# Altium schematic sheet alimentacion.SchDoc
size 431 x 279 mm; SheetNumber: 1; SheetTotal: 2
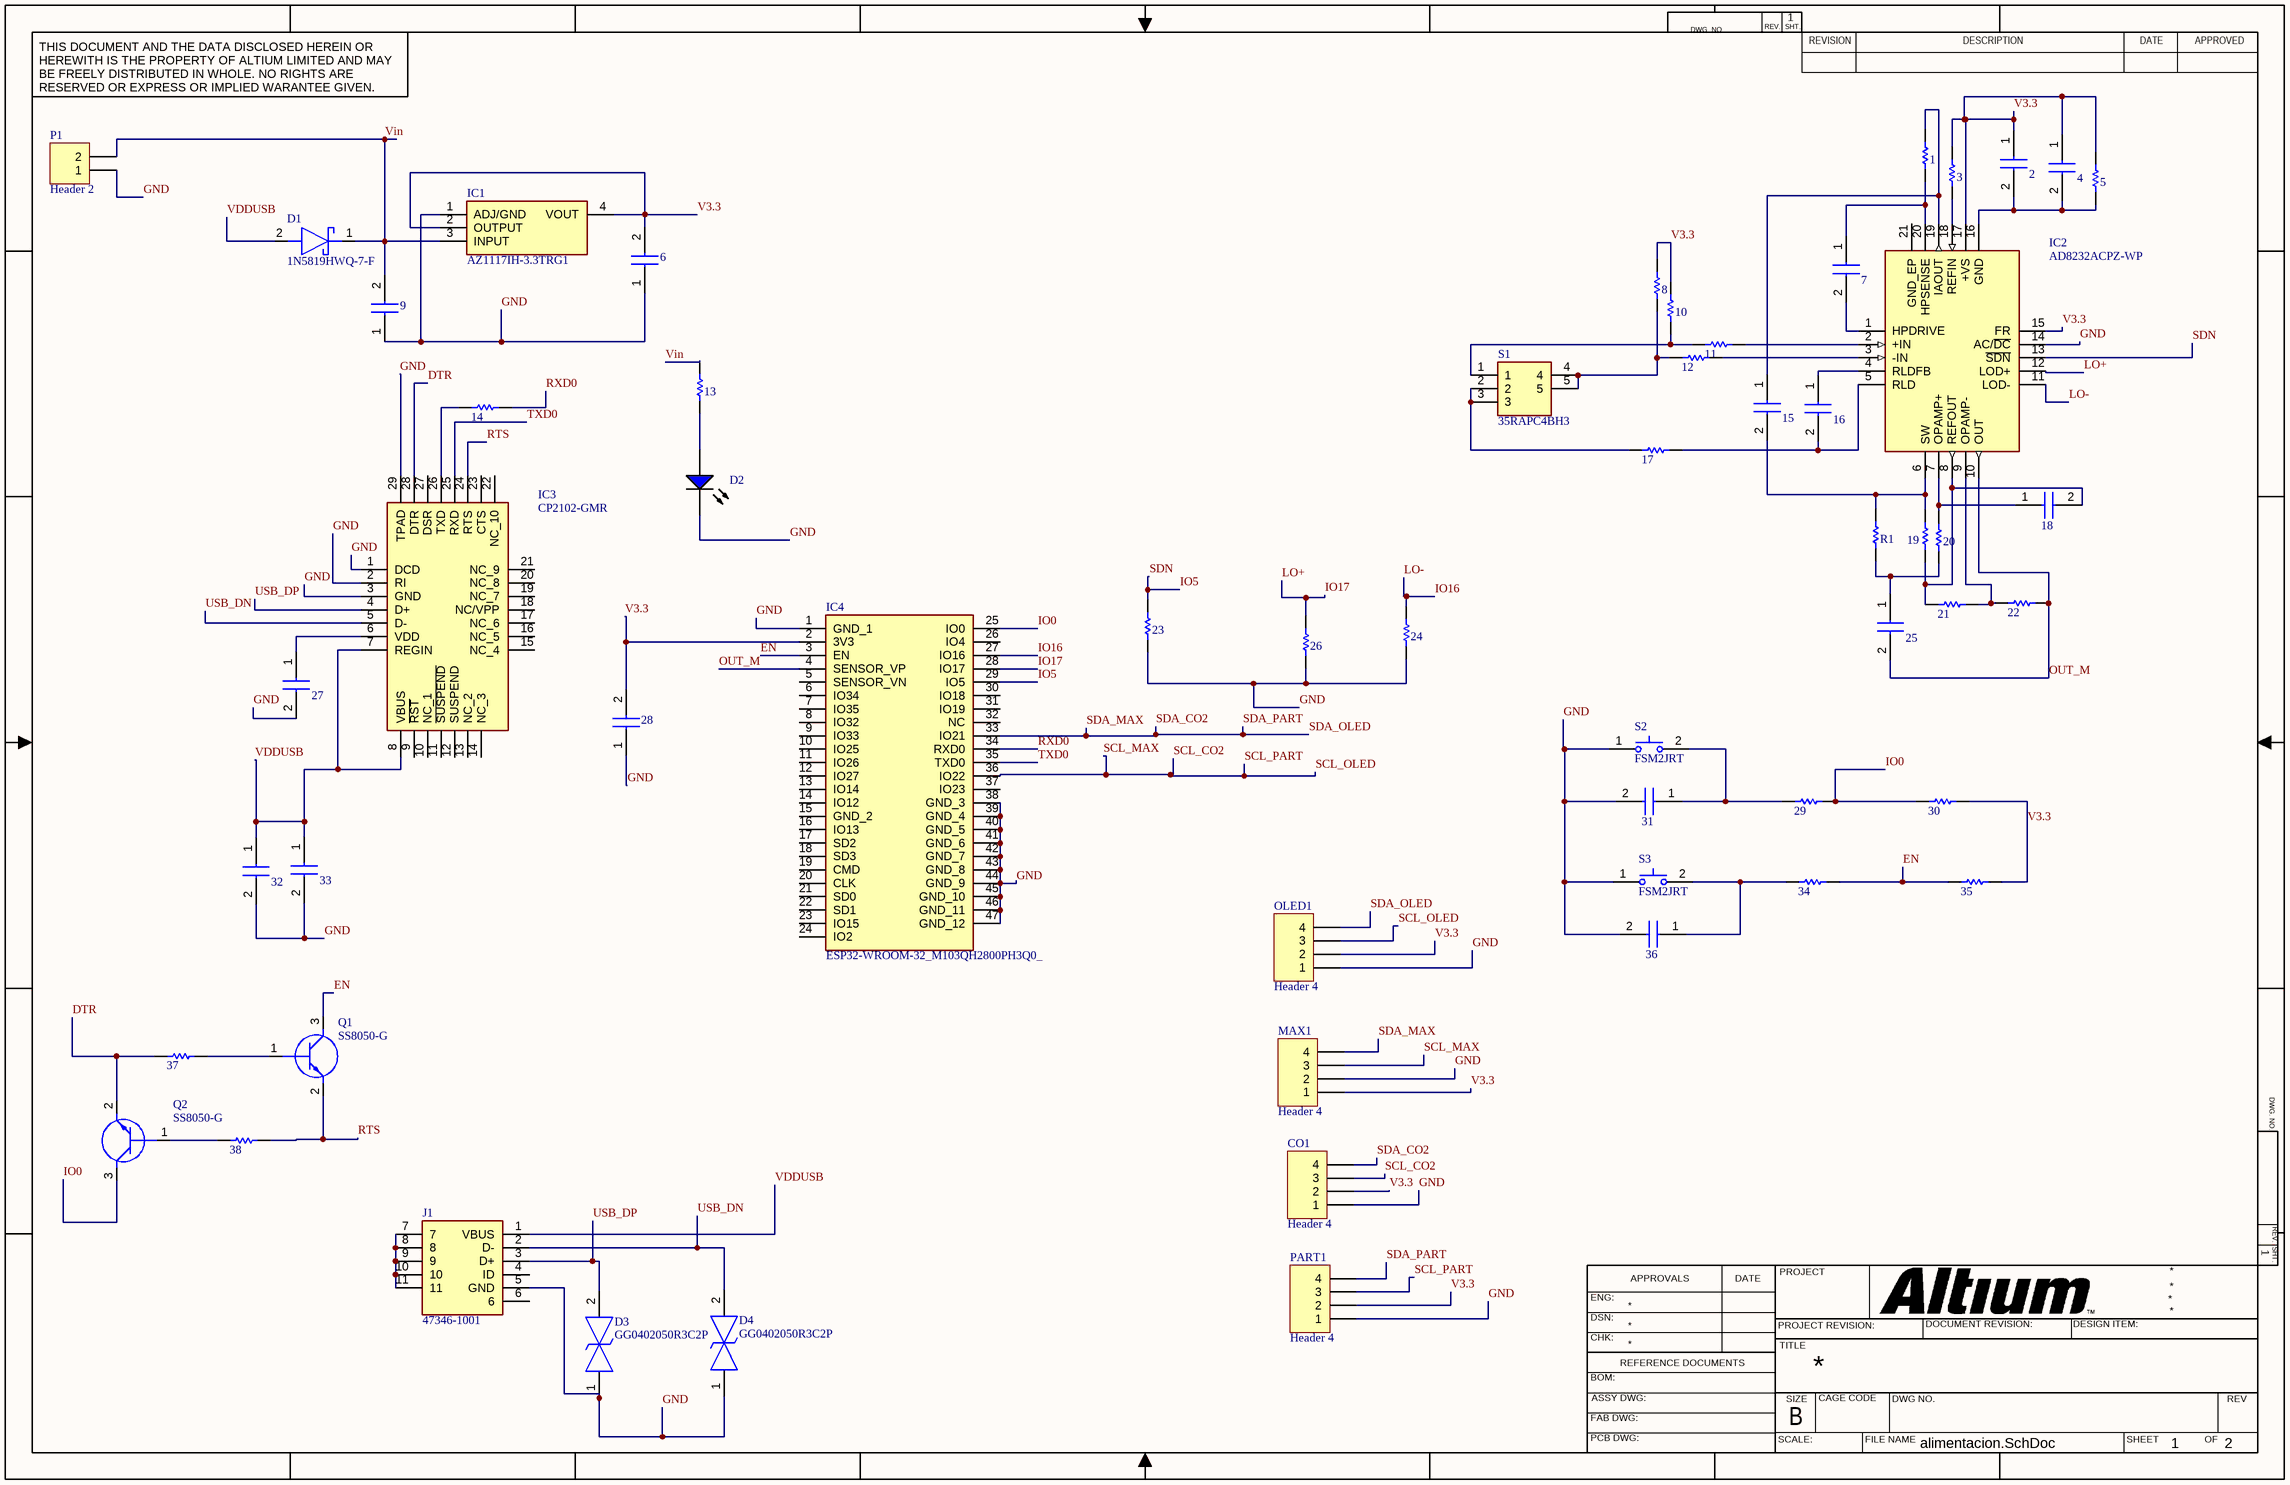
[diagram p0: alimentacion.SchDoc]

## Parts
1  ERA3AEB1131V  [RESC1608X55X30ML20T20]  (value not drawn)
2  C0603C103J5RAC  [CAPC1608X87N]  (value not drawn)
3  ERA3AEB1131V  [RESC1608X55X30ML20T20]  (value not drawn)
4  C0603C103J5RAC  [CAPC1608X87N]  (value not drawn)
5  ERA3AEB1131V  [RESC1608X55X30ML20T20]  (value not drawn)
6  C0603C103J5RAC  [CAPC1608X87N]  (value not drawn)
7  C0603C103J5RAC  [CAPC1608X87N]  (value not drawn)
8  ERA3AEB1131V  [RESC1608X55X30ML20T20]  (value not drawn)
9  C0603C103J5RAC  [CAPC1608X87N]  (value not drawn)
10  ERA3AEB1131V  [RESC1608X55X30ML20T20]  (value not drawn)
11  ERA3AEB1131V  [RESC1608X55X30ML20T20]  (value not drawn)
12  ERA3AEB1131V  [RESC1608X55X30ML20T20]  (value not drawn)
13  ERA3AEB1131V  [RESC1608X55X30ML20T20]  (value not drawn)
14  ERA3AEB1131V  [RESC1608X55X30ML20T20]  (value not drawn)
15  C0603C103J5RAC  [CAPC1608X87N]  (value not drawn)
16  C0603C103J5RAC  [CAPC1608X87N]  (value not drawn)
17  ERA3AEB1131V  [RESC1608X55X30ML20T20]  (value not drawn)
18  C0603C103J5RAC  [CAPC1608X87N]  (value not drawn)
19  ERA3AEB1131V  [RESC1608X55X30ML20T20]  (value not drawn)
20  ERA3AEB1131V  [RESC1608X55X30ML20T20]  (value not drawn)
21  ERA3AEB1131V  [RESC1608X55X30ML20T20]  (value not drawn)
22  ERA3AEB1131V  [RESC1608X55X30ML20T20]  (value not drawn)
23  ERA3AEB1131V  [RESC1608X55X30ML20T20]  (value not drawn)
24  ERA3AEB1131V  [RESC1608X55X30ML20T20]  (value not drawn)
25  C0603C103J5RAC  [CAPC1608X87N]  (value not drawn)
26  ERA3AEB1131V  [RESC1608X55X30ML20T20]  (value not drawn)
27  C0603C103J5RAC  [CAPC1608X87N]  (value not drawn)
28  C0603C103J5RAC  [CAPC1608X87N]  (value not drawn)
29  ERA3AEB1131V  [RESC1608X55X30ML20T20]  (value not drawn)
30  ERA3AEB1131V  [RESC1608X55X30ML20T20]  (value not drawn)
31  C0603C103J5RAC  [CAPC1608X87N]  (value not drawn)
32  C0603C103J5RAC  [CAPC1608X87N]  (value not drawn)
33  C0603C103J5RAC  [CAPC1608X87N]  (value not drawn)
34  ERA3AEB1131V  [RESC1608X55X30ML20T20]  (value not drawn)
35  ERA3AEB1131V  [RESC1608X55X30ML20T20]  (value not drawn)
36  C0603C103J5RAC  [CAPC1608X87N]  (value not drawn)
37  ERA3AEB1131V  [RESC1608X55X30ML20T20]  (value not drawn)
38  ERA3AEB1131V  [RESC1608X55X30ML20T20]  (value not drawn)
CO1  Header 4  [HDR1X4]
D1  1N5819HWQ-7-F  [SOD3716X145N]
D2  TLMB1100-GS08  [VISH-TLMX1100-2_V]  (value not drawn)
D3  GG0402050R3C2P  [DIONC1006X55N]
D4  GG0402050R3C2P  [DIONC1006X55N]
IC1  AZ1117IH-3.3TRG1  [SOT230P700X180-4N]
IC2  AD8232ACPZ-WP  [QFN50P400X400X80-21N-D]
IC3  CP2102-GMR  [QFN50P500X500X100-29N-D]
IC4  ESP32-WROOM-32_M103QH2800PH3Q0_  [ESP32WROOM32M103QH2800PH3Q0]
J1  47346-1001  [473461001]
MAX1  Header 4  [HDR1X4]
OLED1  Header 4  [HDR1X4]
P1  Header 2  [HDR1X2]
PART1  Header 4  [HDR1X4]
Q1  SS8050-G  [SOT95P240X115-3N]
Q2  SS8050-G  [SOT95P240X115-3N]
R1  ERA3AEB1131V  [RESC1608X55X30ML20T20]  (value not drawn)
S1  35RAPC4BH3  [35RAPC4BH3]
S2  FSM2JRT  [FSM2JRT]
S3  FSM2JRT  [FSM2JRT]

## Nets
DTR: 37.2 IC3.28(DTR) Q2.2(E)
EN: 34.1 35.2 IC4.3(EN) Q1.3(C)
GND: 6.1 9.1 23.2 24.2 26.2 27.2 28.1 31.2 32.2 33.2 36.2 CO1.1 D2.2(K) D3.1 D4.1 IC1.1(ADJ/GND) IC2.14(AC/~{DC}) IC3.1(DCD) IC3.2(RI) IC3.3(GND) IC3.29(TPAD) IC4.1(GND_1) IC4.38(GND_3) IC4.39(GND_4) IC4.40(GND_5) IC4.41(GND_6) IC4.42(GND_7) IC4.43(GND_8) IC4.44(GND_9) IC4.45(GND_10) IC4.46(GND_11) IC4.47(GND_12) J1.5(GND) MAX1.2 OLED1.1 P1.1 PART1.1 S2.1(COM) S3.1(COM)
IO0: 29.1 30.2 IC4.25(IO0) Q2.3(C)
IO5: 23.1 IC2.13(~{SDN}) IC4.29(IO5)  [also labelled SDN]
IO16: 24.1 IC2.11(LOD-) IC4.27(IO16)  [also labelled LO-]
IO17: 26.1 IC2.12(LOD+) IC4.28(IO17)  [also labelled LO+]
OUT_M: 22.1 25.2 IC2.10(OUT) IC4.4(SENSOR_VP)
RTS: 38.1 IC3.24(RTS) Q1.2(E)
RXD0: 14.1 IC4.34(RXD0)
SCL_CO2: CO1.3 IC4.36(IO22) MAX1.3 OLED1.3 PART1.3  [also labelled SCL_MAX, SCL_OLED, SCL_PART]
SDA_CO2: CO1.4 IC4.33(IO21) MAX1.4 OLED1.4 PART1.4  [also labelled SDA_MAX, SDA_OLED, SDA_PART]
TXD0: IC3.25(RXD) IC4.35(TXD0)
USB_DN: D4.2 IC3.5(D-) J1.2(D-)
USB_DP: D3.2 IC3.4(D+) J1.3(D+)
V3.3: 2.1 3.1 4.1 5.1 6.2 8.1 10.1 28.2 30.1 35.1 CO1.2 IC1.2(OUTPUT) IC1.4(VOUT) IC2.15(FR) IC2.17(+VS) IC4.2(3V3) MAX1.1 OLED1.2 PART1.2
VDDUSB: 32.1 33.1 D1.2(A) IC3.7(REGIN) IC3.8(VBUS) J1.1(VBUS)
Vin: 9.2 13.2 D1.1(K) IC1.3(INPUT) P1.2
Net1_1: 1.1 15.1 IC2.19(IAOUT)
Net1_2: 1.2 7.1 IC2.20(HPSENSE)
Net2_2: 2.2 4.2 5.2 IC2.16(GND)
Net3_2: 3.2 IC2.18(REFIN)
Net7_2: 7.2 IC2.1(HPDRIVE)
Net8_2: 8.2 12.2 S1.4 S1.5
Net10_2: 10.2 11.2 S1.1
Net11_1: 11.1 IC2.2(+IN)
Net12_1: 12.1 IC2.3(-IN)
Net13_1: 13.1 D2.1(A)
Net14_2: 14.2 IC3.26(TXD)
Net15_2: 15.2 19.1 IC2.6(SW) R1.1
Net16_1: 16.1 IC2.4(RLDFB)
Net16_2: 16.2 17.2 IC2.5(RLD)
Net17_1: 17.1 S1.2 S1.3
Net18_1: 18.1 20.1 IC2.7(OPAMP+)
Net18_2: 18.2 19.2 21.1 IC2.8(REFOUT)
Net20_2: 20.2 25.1 R1.2
Net21_2: 21.2 22.2 IC2.9(OPAMP-)
Net27_1: 27.1 IC3.6(VDD)
Net29_2: 29.2 31.1 S2.2(NO)
Net34_2: 34.2 36.1 S3.2(NO)
Net37_1: 37.1 Q1.1(B)
Net38_2: 38.2 Q2.1(B)
NetJ1_7: J1.7 J1.8 J1.9 J1.10 J1.11

Not connected (* = marked no-connect by the designer): IC2 21(GND_EP); IC3 9(~{RST}) 10(NC_1) 11(~{SUSPEND}) 12(SUSPEND) 13(NC_2) 14(NC_3) 15(NC_4) 16(NC_5) 17(NC_6) 18(NC/VPP) 19(NC_7) 20(NC_8) 21(NC_9) 22(NC_10) 23(CTS) 27(DSR); IC4 5(SENSOR_VN) 6(IO34) 7(IO35) 8(IO32) 9(IO33) 10(IO25) 11(IO26) 12(IO27) 13(IO14) 14(IO12) 15(GND_2) 16(IO13) 17(SD2) 18(SD3) 19(CMD) 20(CLK) 21(SD0) 22(SD1) 23(IO15) 24(IO2) 26(IO4) 30(IO18) 31(IO19) 32(NC) 37(IO23); J1 4(ID) 6

## Notes on the sheet
- DWG. NO.
- REV.
- SHT.
- THIS DOCUMENT AND THE DATA DISCLOSED HEREIN OR HEREWITH IS THE PROPERTY OF ALTIUM LIMITED AND MAY BE FREELY DISTRIBUTED IN WHOLE. NO RIGHTS ARE RESERVED OR EXPRESS OR IMPLIED WARANTEE GIVEN.
- REVISION
- DESCRIPTION
- DATE
- APPROVED
- ENG:
- APPROVALS
- PROJECT
- DSN:
- CHK:
- REFERENCE DOCUMENTS
- PROJECT REVISION:
- TITLE
- DOCUMENT REVISION:
- DESIGN ITEM:
- BOM:
- FAB DWG:
- PCB DWG:
- ASSY DWG:
- SCALE:
- SIZE
- B
- CAGE CODE
- FILE NAME
- DWG NO.
- SHEET
- OF
- REV

## Library data of the parts
1 3 5 8 10-14 17 19-24 26 29 30 34 35 37 38 R1 = CMP-2000-00883-1: Manufacturer: Panasonic; Part Number: ERA3AEB1131V
2 4 6 7 9 15 16 18 25 27 28 31-33 36 = C0603C103J5RAC: Capacitor; Manufacturer_Name: KEMET; Datasheet Link: https://www.kemet.com/specsheet/C0603C103J5RAC%7BBULK%7D; Height: 0.87mm; Manufacturer_Part_Number: C0603C103J5RAC; Mouser Part Number: 80-C0603C103J5RAC; Mouser Price/Stock: https://www.mouser.co.uk/ProductDetail/KEMET/C0603C103J5RAC?qs=Zjfhvh7dXTOjKlZBdCXdvg%3D%3D; Arrow Part Number: C0603C103J5RAC; Arrow Price/Stock: https://www.arrow.com/en/products/c0603c103j5rac/kemet-corporation?region=nac
CO1 MAX1 OLED1 PART1 = Header 4: Header, 4-Pin; LatestRevisionDate: 17-Jul-2002; LatestRevisionNote: Re-released for DXP Platform.; Publisher: Altium Limited
D1 = 1N5819HWQ-7-F: Schottky Diode; Manufacturer_Name: Diodes Inc.; Datasheet Link: https://eu.mouser.com/datasheet/2/115/ds30217-1532212.pdf; Height: 1.45mm; Manufacturer_Part_Number: 1N5819HWQ-7-F; Mouser Part Number: 621-1N5819HWQ-7-F; Mouser Price/Stock: https://www.mouser.co.uk/ProductDetail/Diodes-Incorporated/1N5819HWQ-7-F?qs=gZXFycFWdAPDr8BmsK1ygg%3D%3D; Arrow Part Number: 1N5819HWQ-7-F; Arrow Price/Stock: https://www.arrow.com/en/products/1n5819hwq-7-f/diodes-incorporated?region=nac
D2 = CMP-1666-00028-1: Blue LED, 10 mA, 3.9 V, -40 to 100 degC, 2-Pin SMD (0603), RoHS, Tape and Reel; Tolerance: 10%; Voltage Rating: 100 V; Capacitance: 10 nF; Type (Capacitors): X7R; Case\Package: Radial; ComponentLink1Description: Manufacturer URL; REACH SVHC: No SVHC; Package Quantity: 500; PackageDescription: 2-Pin Surface Mount Device, Body 1.6 x 0.8 mm; Pins: 2; ComponentLink2URL: http://download.siliconexpert.com/pdfs/2016/8/7/12/43/26/667/vsh_/manual/379263299541529tlmb1100.pdf; RoHSCompliant: true; Lead Pitch: 2.54 mm; Height: 2.54 mm; DatasheetVersion: Rev. 2.7, 03/2016; Length: 5.33 mm; ComponentLink1URL: http://www.vishay.com/; Min Operating Temperature: -55 degC; PackageReference: 0603; Packaging: Bulk; ComponentLink2Description: Datasheet; Max Operating Temperature: 125 degC; Radiation Hardening: No; Width: 3.81 mm; Mount: Through Hole
D3 D4 = GG0402050R3C2P: TVS Diode (Bi-directional); Manufacturer_Name: AVX; Datasheet Link: https://mouser.componentsearchengine.com/Datasheets/1/GG0402050R3C2P.pdf; Height: 0.55mm; Manufacturer_Part_Number: GG0402050R3C2P; Mouser Part Number: 581-GG0402050R3C2P; Mouser Price/Stock: https://www.mouser.co.uk/ProductDetail/AVX/GG0402050R3C2P?qs=AQlKX63v8RvR10PwGJX5PQ%3D%3D; Arrow Part Number: GG0402050R3C2P; Arrow Price/Stock: https://www.arrow.com/en/products/gg0402050r3c2p/avx
IC1 = AZ1117IH-3.3TRG1: Integrated Circuit; Manufacturer_Name: Diodes Inc.; Datasheet Link: http://www.mouser.com/ds/2/115/AZ1117-776390.pdf; Height: 1.8mm; Manufacturer_Part_Number: AZ1117IH-3.3TRG1; Mouser Part Number: 621-AZ1117IH-3.3TRG1; Mouser Price/Stock: https://www.mouser.co.uk/ProductDetail/Diodes-Incorporated/AZ1117IH-3.3TRG1?qs=cpo3%2FpBou2jnS4SxLgAVoA%3D%3D; Arrow Part Number: AZ1117IH-3.3TRG1; Arrow Price/Stock: https://www.arrow.com/en/products/az1117ih-3.3trg1/diodes-incorporated?region=nac
IC2 = AD8232ACPZ-WP: Integrated Circuit; Manufacturer_Name: Analog Devices; Datasheet Link: https://datasheet.datasheetarchive.com/originals/distributors/Datasheets-SFU1/DSASFU10003822.pdf; Height: 0.8mm; Manufacturer_Part_Number: AD8232ACPZ-WP; Mouser Part Number: 584-AD8232ACPZ-WP; Mouser Price/Stock: https://www.mouser.co.uk/ProductDetail/Analog-Devices/AD8232ACPZ-WP?qs=%2FtpEQrCGXCzCRiJ%252BumD7TQ%3D%3D; Arrow Part Number: AD8232ACPZ-WP; Arrow Price/Stock: https://www.arrow.com/en/products/ad8232acpz-wp/analog-devices?region=nac
IC3 = CP2102-GMR: Integrated Circuit; Manufacturer_Name: Silicon Labs; Datasheet Link: https://www.silabs.com/Support%20Documents/TechnicalDocs/CP2102-9.pdf; Height: 1mm; Manufacturer_Part_Number: CP2102-GMR; Mouser Part Number: 634-CP2102-GMR; Mouser Price/Stock: https://www.mouser.co.uk/ProductDetail/Silicon-Labs/CP2102-GMR?qs=cNyzPCcHMUWu%2FiPhR8KQAw%3D%3D; Arrow Part Number: CP2102-GMR; Arrow Price/Stock: https://www.arrow.com/en/products/cp2102-gmr/silicon-labs?region=nac
IC4 = ESP32-WROOM-32_M103QH2800PH3Q0_: Integrated Circuit; Manufacturer_Name: Espressif Systems; Manufacturer_Part_Number: ESP32-WROOM-32(M103QH2800PH3Q0); Datasheet Link: https://th.mouser.com/datasheet/2/891/esp32-wroom-32_datasheet_en-1510934.pdf; Height: 3.2mm; Mouser Part Number: 356-ESPWROOM3216MB; Mouser Price/Stock: https://www.mouser.co.uk/ProductDetail/Espressif-Systems/ESP32-WROOM-32M103QH2800PH3Q0?qs=W%2FMpXkg%252BdQ7IcgHFTTq3Ig%3D%3D
J1 = 47346-1001: Connector; Manufacturer_Name: Molex; Datasheet Link: http://www.molex.com/webdocs/datasheets/pdf/en-us/0473461001_IO_CONNECTORS.pdf; Height: 2.94mm; Manufacturer_Part_Number: 47346-1001; Mouser Part Number: 538-47346-1001; Mouser Price/Stock: https://www.mouser.co.uk/ProductDetail/Molex/47346-1001?qs=yd8XiKYcH9muPqUKe4E0Dw%3D%3D; Arrow Part Number: 47346-1001; Arrow Price/Stock: https://www.arrow.com/en/products/47346-1001/molex?region=nac
P1 = Header 2: Header, 2-Pin; LatestRevisionDate: 17-Jul-2002; LatestRevisionNote: Re-released for DXP Platform.; Publisher: Altium Limited
Q1 Q2 = SS8050-G: Transistor BJT NPN; Manufacturer_Name: Comchip Technology; Datasheet Link: https://datasheet.datasheetarchive.com/originals/distributors/DKDS-12/229454.pdf; Height: 1.15mm; Manufacturer_Part_Number: SS8050-G; Mouser Part Number: 750-SS8050-G; Mouser Price/Stock: https://www.mouser.co.uk/ProductDetail/Comchip-Technology/SS8050-G?qs=LLUE9lz1YbcHg%252BWLMAtcrQ%3D%3D; Arrow Part Number: SS8050-G; Arrow Price/Stock: https://www.arrow.com/en/products/ss8050-g/comchip-technology?region=nac
S1 = 35RAPC4BH3: Switch; Manufacturer_Name: Switchcraft; Datasheet Link: http://www.switchcraft.com/Drawings/35rapc__h3_cd.pdf; Height: 6mm; Manufacturer_Part_Number: 35RAPC4BH3; Mouser Part Number: 502-35RAPC4BH3; Mouser Price/Stock: https://www.mouser.co.uk/ProductDetail/Switchcraft/35RAPC4BH3?qs=I3kMT7EEIOWFGyk5rynRAQ%3D%3D; Arrow Part Number: 35RAPC4BH3; Arrow Price/Stock: https://www.arrow.com/en/products/35rapc4bh3/switchcraft
S2 S3 = FSM2JRT: Switch (2-Pin Push); Manufacturer_Name: TE Connectivity; Datasheet Link: http://www.farnell.com/datasheets/2074947.pdf; Height: 4.3mm; Manufacturer_Part_Number: FSM2JRT; Mouser Part Number: 506-FSM2JRT; Mouser Price/Stock: https://www.mouser.co.uk/ProductDetail/TE-Connectivity-PB/FSM2JRT?qs=g%252BEszo6zu8OVk6hda53nSw%3D%3D; Arrow Part Number: FSM2JRT; Arrow Price/Stock: https://www.arrow.com/en/products/fsm2jrt/te-connectivity?region=nac